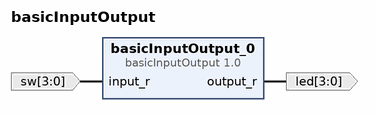
[diagram p0: block diagram of the top level]
# Vivado block design basicInputOutput, xc7z020clg400-1, Vivado 2022.2
create_bd_design basicInputOutput

create_bd_port -dir I -from 3 -to 0 -type data sw
create_bd_port -dir O -from 3 -to 0 -type data led

create_bd_cell -type ip -vlnv xilinx.com:hls:basicInputOutput:1.0 basicInputOutput_0

# ---- connections ----

connect_bd_net [get_bd_pins basicInputOutput_0/output_r] [get_bd_ports led]
connect_bd_net -net input_r_0_1 [get_bd_ports sw] [get_bd_pins basicInputOutput_0/input_r]

validate_bd_design
save_bd_design
